# Altium schematic sheet Sensor_Array_No_Diodes.SchDoc
size C
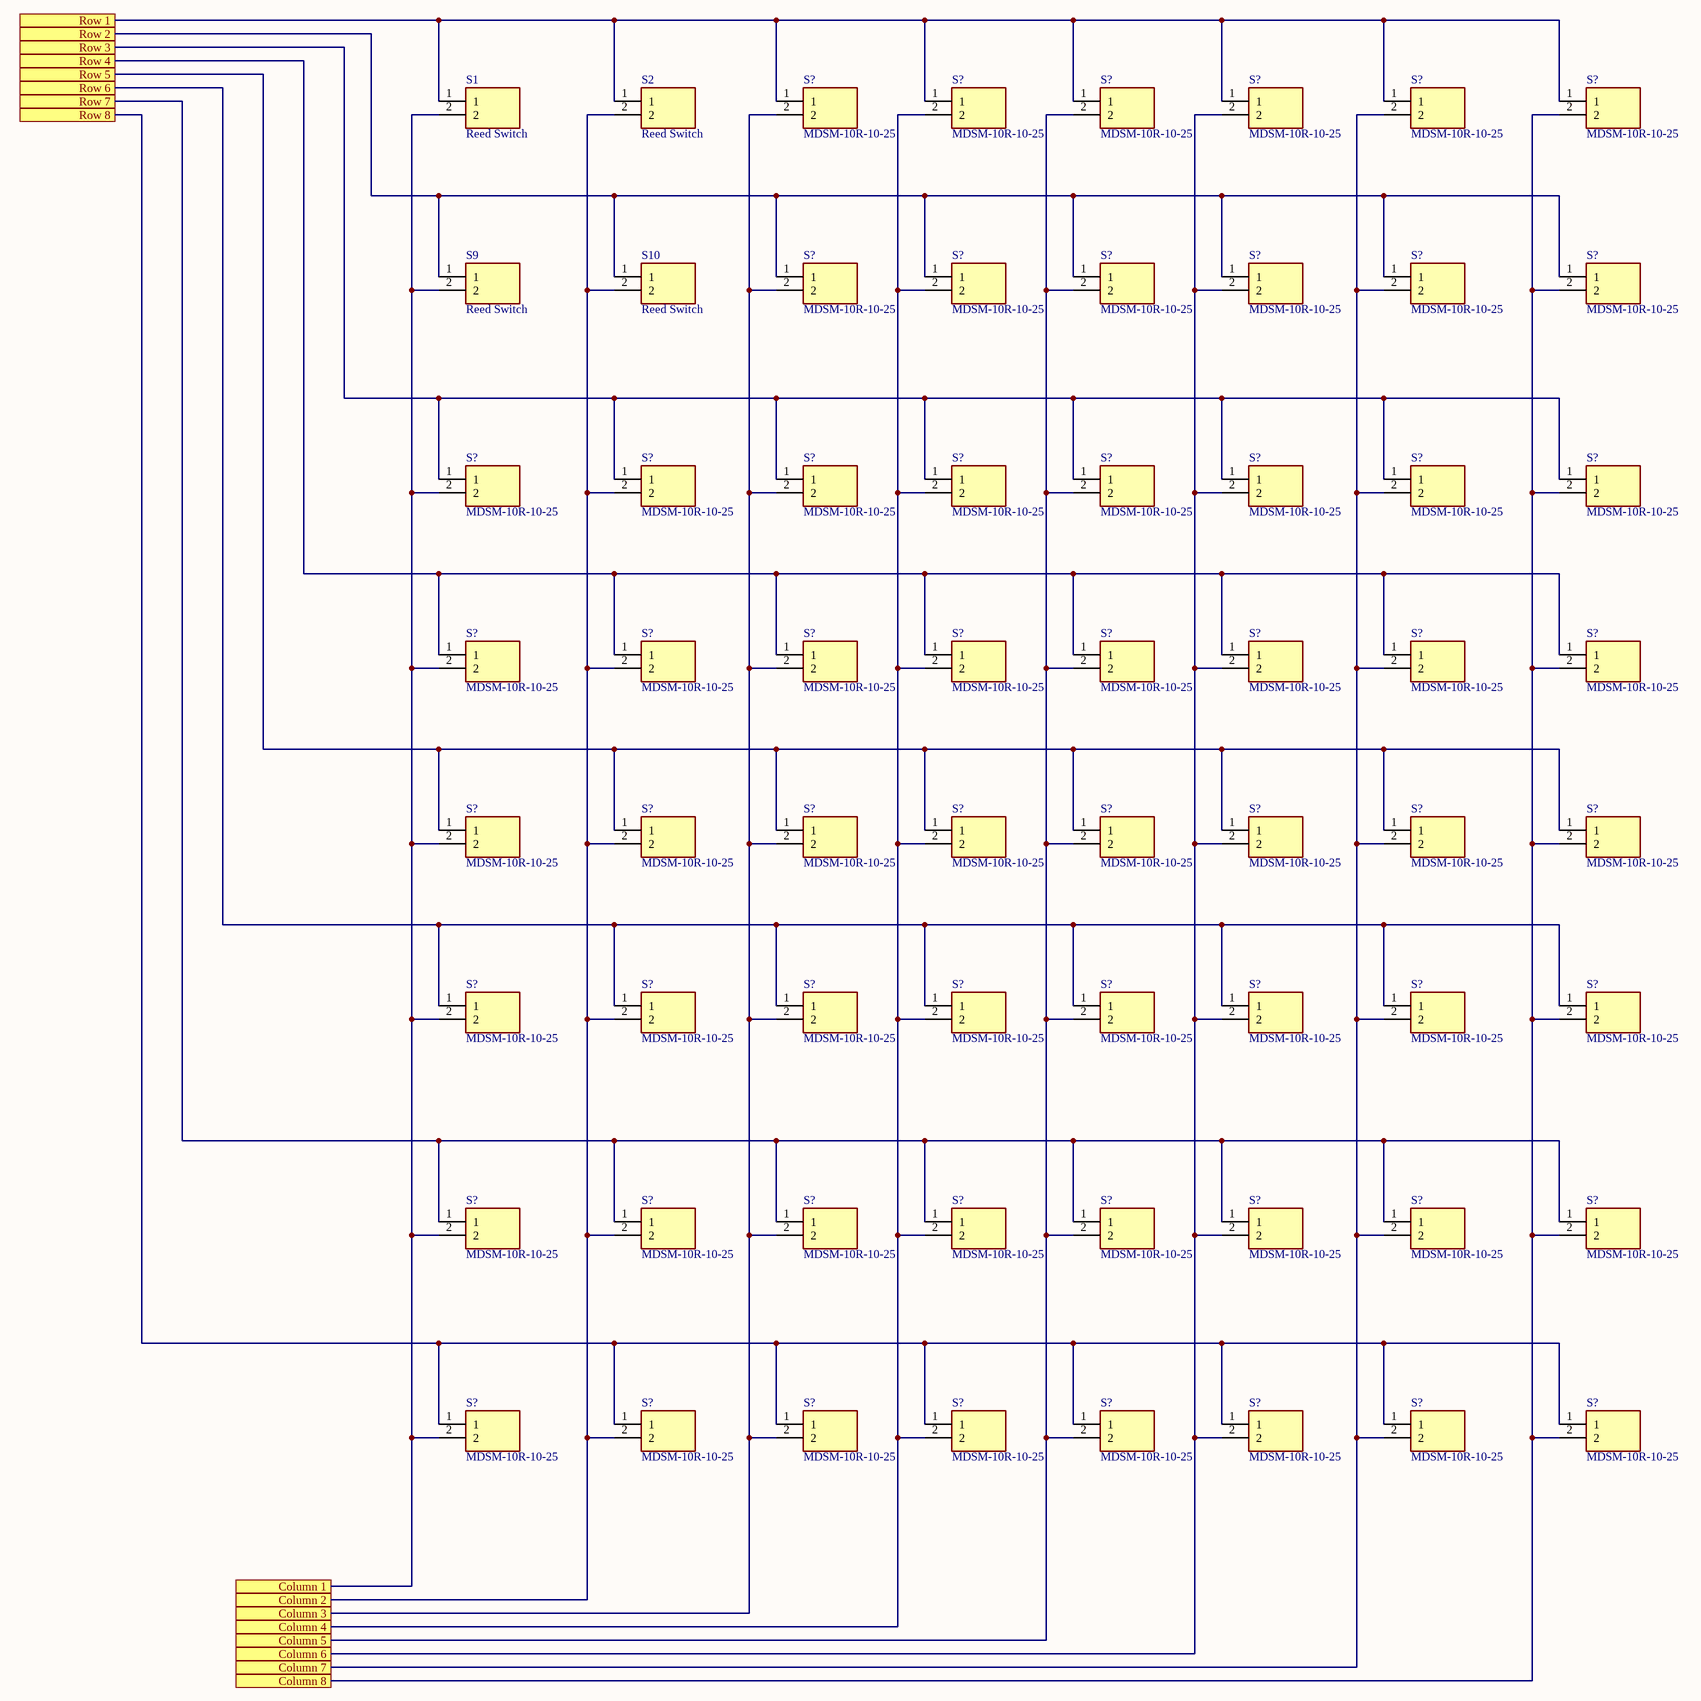
[diagram p0: Sensor_Array_No_Diodes.SchDoc]

## Parts
(Parts that share a designator on the sheet are numbered #1, #2 ... from top to bottom, then left to right.)
S1  Reed Switch  [MDSM10R1025]
S2  Reed Switch  [MDSM10R1025]
S9  Reed Switch  [MDSM10R1025]
S10  Reed Switch  [MDSM10R1025]
S?#1  MDSM-10R-10-25  [MDSM10R1025]
S?#2  MDSM-10R-10-25  [MDSM10R1025]
S?#3  MDSM-10R-10-25  [MDSM10R1025]
S?#4  MDSM-10R-10-25  [MDSM10R1025]
S?#5  MDSM-10R-10-25  [MDSM10R1025]
S?#6  MDSM-10R-10-25  [MDSM10R1025]
S?#7  MDSM-10R-10-25  [MDSM10R1025]
S?#8  MDSM-10R-10-25  [MDSM10R1025]
S?#9  MDSM-10R-10-25  [MDSM10R1025]
S?#10  MDSM-10R-10-25  [MDSM10R1025]
S?#11  MDSM-10R-10-25  [MDSM10R1025]
S?#12  MDSM-10R-10-25  [MDSM10R1025]
S?#13  MDSM-10R-10-25  [MDSM10R1025]
S?#14  MDSM-10R-10-25  [MDSM10R1025]
S?#15  MDSM-10R-10-25  [MDSM10R1025]
S?#16  MDSM-10R-10-25  [MDSM10R1025]
S?#17  MDSM-10R-10-25  [MDSM10R1025]
S?#18  MDSM-10R-10-25  [MDSM10R1025]
S?#19  MDSM-10R-10-25  [MDSM10R1025]
S?#20  MDSM-10R-10-25  [MDSM10R1025]
S?#21  MDSM-10R-10-25  [MDSM10R1025]
S?#22  MDSM-10R-10-25  [MDSM10R1025]
S?#23  MDSM-10R-10-25  [MDSM10R1025]
S?#24  MDSM-10R-10-25  [MDSM10R1025]
S?#25  MDSM-10R-10-25  [MDSM10R1025]
S?#26  MDSM-10R-10-25  [MDSM10R1025]
S?#27  MDSM-10R-10-25  [MDSM10R1025]
S?#28  MDSM-10R-10-25  [MDSM10R1025]
S?#29  MDSM-10R-10-25  [MDSM10R1025]
S?#30  MDSM-10R-10-25  [MDSM10R1025]
S?#31  MDSM-10R-10-25  [MDSM10R1025]
S?#32  MDSM-10R-10-25  [MDSM10R1025]
S?#33  MDSM-10R-10-25  [MDSM10R1025]
S?#34  MDSM-10R-10-25  [MDSM10R1025]
S?#35  MDSM-10R-10-25  [MDSM10R1025]
S?#36  MDSM-10R-10-25  [MDSM10R1025]
S?#37  MDSM-10R-10-25  [MDSM10R1025]
S?#38  MDSM-10R-10-25  [MDSM10R1025]
S?#39  MDSM-10R-10-25  [MDSM10R1025]
S?#40  MDSM-10R-10-25  [MDSM10R1025]
S?#41  MDSM-10R-10-25  [MDSM10R1025]
S?#42  MDSM-10R-10-25  [MDSM10R1025]
S?#43  MDSM-10R-10-25  [MDSM10R1025]
S?#44  MDSM-10R-10-25  [MDSM10R1025]
S?#45  MDSM-10R-10-25  [MDSM10R1025]
S?#46  MDSM-10R-10-25  [MDSM10R1025]
S?#47  MDSM-10R-10-25  [MDSM10R1025]
S?#48  MDSM-10R-10-25  [MDSM10R1025]
S?#49  MDSM-10R-10-25  [MDSM10R1025]
S?#50  MDSM-10R-10-25  [MDSM10R1025]
S?#51  MDSM-10R-10-25  [MDSM10R1025]
S?#52  MDSM-10R-10-25  [MDSM10R1025]
S?#53  MDSM-10R-10-25  [MDSM10R1025]
S?#54  MDSM-10R-10-25  [MDSM10R1025]
S?#55  MDSM-10R-10-25  [MDSM10R1025]
S?#56  MDSM-10R-10-25  [MDSM10R1025]
S?#57  MDSM-10R-10-25  [MDSM10R1025]
S?#58  MDSM-10R-10-25  [MDSM10R1025]
S?#59  MDSM-10R-10-25  [MDSM10R1025]
S?#60  MDSM-10R-10-25  [MDSM10R1025]

## Ports
Column 1, Column 2, Column 3, Column 4, Column 5, Column 6, Column 7, Column 8, Row 1, Row 2, Row 3, Row 4, Row 5, Row 6, Row 7, Row 8

## Nets
Column 1: S1.2 S9.2 S?#13.2 S?#21.2 S?#29.2 S?#37.2 S?#45.2 S?#53.2 ; port Column 1
Column 2: S2.2 S10.2 S?#14.2 S?#22.2 S?#30.2 S?#38.2 S?#46.2 S?#54.2 ; port Column 2
Column 3: S?#1.2 S?#7.2 S?#15.2 S?#23.2 S?#31.2 S?#39.2 S?#47.2 S?#55.2 ; port Column 3
Column 4: S?#2.2 S?#8.2 S?#16.2 S?#24.2 S?#32.2 S?#40.2 S?#48.2 S?#56.2 ; port Column 4
Column 5: S?#3.2 S?#9.2 S?#17.2 S?#25.2 S?#33.2 S?#41.2 S?#49.2 S?#57.2 ; port Column 5
Column 6: S?#4.2 S?#10.2 S?#18.2 S?#26.2 S?#34.2 S?#42.2 S?#50.2 S?#58.2 ; port Column 6
Column 7: S?#5.2 S?#11.2 S?#19.2 S?#27.2 S?#35.2 S?#43.2 S?#51.2 S?#59.2 ; port Column 7
Column 8: S?#6.2 S?#12.2 S?#20.2 S?#28.2 S?#36.2 S?#44.2 S?#52.2 S?#60.2 ; port Column 8
Row 1: S1.1 S2.1 S?#1.1 S?#2.1 S?#3.1 S?#4.1 S?#5.1 S?#6.1 ; port Row 1
Row 2: S9.1 S10.1 S?#7.1 S?#8.1 S?#9.1 S?#10.1 S?#11.1 S?#12.1 ; port Row 2
Row 3: S?#13.1 S?#14.1 S?#15.1 S?#16.1 S?#17.1 S?#18.1 S?#19.1 S?#20.1 ; port Row 3
Row 4: S?#21.1 S?#22.1 S?#23.1 S?#24.1 S?#25.1 S?#26.1 S?#27.1 S?#28.1 ; port Row 4
Row 5: S?#29.1 S?#30.1 S?#31.1 S?#32.1 S?#33.1 S?#34.1 S?#35.1 S?#36.1 ; port Row 5
Row 6: S?#37.1 S?#38.1 S?#39.1 S?#40.1 S?#41.1 S?#42.1 S?#43.1 S?#44.1 ; port Row 6
Row 7: S?#45.1 S?#46.1 S?#47.1 S?#48.1 S?#49.1 S?#50.1 S?#51.1 S?#52.1 ; port Row 7
Row 8: S?#53.1 S?#54.1 S?#55.1 S?#56.1 S?#57.1 S?#58.1 S?#59.1 S?#60.1 ; port Row 8

## Library data of the parts
S1 S2 S9 S10 S?#1-S?#60 = MDSM-10R-10-25: Switch; Manufacturer_Name: LITTELFUSE; Datasheet Link: https://www.littelfuse.com/~/media/electronics/datasheets/reed_switches/littelfuse_reed_switches_mdsm_10_datasheet.pdf.pdf; Height: 2mm; Manufacturer_Part_Number: MDSM-10R-10-25; Mouser Part Number: 934-MDSM-10R10-25; Mouser Price/Stock: https://www.mouser.co.uk/ProductDetail/Littelfuse/MDSM-10R-10-25?qs=nyo4TFax6Nce6Y4AmbWmcw%3D%3D; Arrow Part Number: MDSM-10R-10-25; Arrow Price/Stock: https://www.arrow.com/en/products/mdsm-10r-10-25/littelfuse